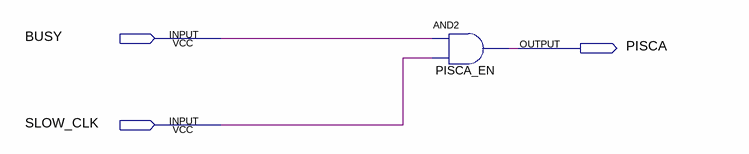
[diagram p0: schematic sheet]
// Quartus schematic Sinaliza.bdf as structural Verilog: 1 symbols, 3 pins
module Sinaliza (
  input  BUSY,
  input  SLOW_CLK,
  output PISCA
);

  and PISCA_EN (PISCA, BUSY, SLOW_CLK);
endmodule
